# Altium schematic sheet Power.SchDoc
size A4
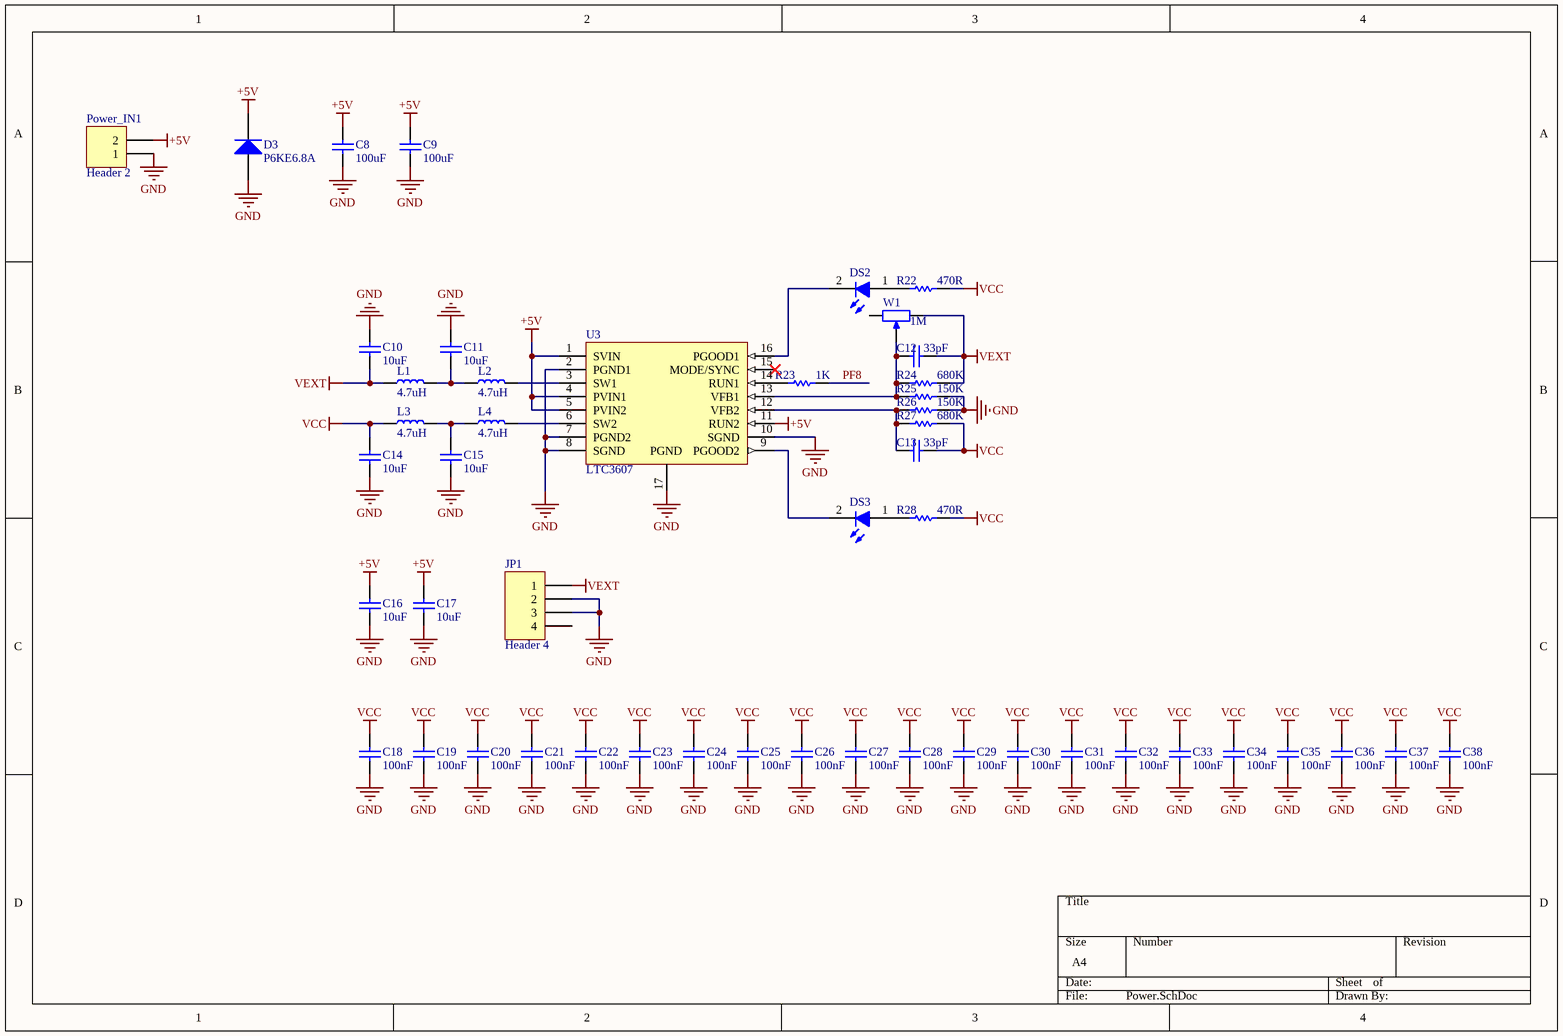
[diagram p0: Power.SchDoc]

## Parts
C8  100uF  [CAPC3225]
C9  100uF  [CAPC3225]
C10  10uF  [CAPC0805(2012)75_M]
C11  10uF  [CAPC0805(2012)75_M]
C12  33pF  [CAPC0603(1608)55_M]
C13  33pF  [CAPC0603(1608)55_M]
C14  10uF  [CAPC0805(2012)75_M]
C15  10uF  [CAPC0805(2012)75_M]
C16  10uF  [CAPC0805(2012)75_M]
C17  10uF  [CAPC0805(2012)75_M]
C18  100nF  [CAPC0603(1608)55_M]
C19  100nF  [CAPC0603(1608)55_M]
C20  100nF  [CAPC0603(1608)55_M]
C21  100nF  [CAPC0603(1608)55_M]
C22  100nF  [CAPC0603(1608)55_M]
C23  100nF  [CAPC0603(1608)55_M]
C24  100nF  [CAPC0603(1608)55_M]
C25  100nF  [CAPC0603(1608)55_M]
C26  100nF  [CAPC0603(1608)55_M]
C27  100nF  [CAPC0603(1608)55_M]
C28  100nF  [CAPC0603(1608)55_M]
C29  100nF  [CAPC0603(1608)55_M]
C30  100nF  [CAPC0603(1608)55_M]
C31  100nF  [CAPC0603(1608)55_M]
C32  100nF  [CAPC0603(1608)55_M]
C33  100nF  [CAPC0603(1608)55_M]
C34  100nF  [CAPC0603(1608)55_M]
C35  100nF  [CAPC0603(1608)55_M]
C36  100nF  [CAPC0603(1608)55_M]
C37  100nF  [CAPC0603(1608)55_M]
C38  100nF  [CAPC0603(1608)55_M]
D3  P6KE6.8A  [DO-214AC]
DS2  LED-BLUE  [0603LED_BLUE_V]  (value not drawn)
DS3  LED-BLUE  [0603LED_BLUE_V]  (value not drawn)
JP1  Header 4  [3.96-4-A]
L1  4.7uH  [CD32]
L2  4.7uH  [CD32]
L3  4.7uH  [CD32]
L4  4.7uH  [CD32]
Power_IN1  Header 2  [VH3.96-2-AW]
R22  470R  [RESC0603(1608)_M]
R23  1K  [RESC0603(1608)_M]
R24  680K  [RESC0603(1608)_M]
R25  150K  [RESC0603(1608)_M]
R26  150K  [RESC0603(1608)_M]
R27  680K  [RESC0603(1608)_M]
R28  470R  [RESC0603(1608)_M]
U3  LTC3607  [MSE16]
W1  1M  [VR5]

## Nets
+5V: C8.2 C9.2 C16.2 C17.2 D3.1(K) Power_IN1.2 U3.1(SVIN) U3.4(PVIN1) U3.5(PVIN2) U3.11(RUN2)
GND: C8.1 C9.1 C10.2 C11.2 C14.2 C15.2 C16.1 C17.1 C18.1 C19.1 C20.1 C21.1 C22.1 C23.1 C24.1 C25.1 C26.1 C27.1 C28.1 C29.1 C30.1 C31.1 C32.1 C33.1 C34.1 C35.1 C36.1 C37.1 C38.1 D3.2(A) JP1.2 JP1.3 Power_IN1.1 R25.1 R26.1 U3.2(PGND1) U3.7(PGND2) U3.8(SGND) U3.10(SGND) U3.17(PGND)
VCC: C13.2 C14.1 C18.2 C19.2 C20.2 C21.2 C22.2 C23.2 C24.2 C25.2 C26.2 C27.2 C28.2 C29.2 C30.2 C31.2 C32.2 C33.2 C34.2 C35.2 C36.2 C37.2 C38.2 L3.1 R22.1 R27.1 R28.1
VEXT: C10.1 C12.2 JP1.1 L1.1 R24.1 W1.3(BOT)
PF8: R23.1
NetC11_1: C11.1 L1.2 L2.1
NetC12_1: C12.1 R24.2 R25.2 U3.13(VFB1) W1.2(TAP)
NetC13_1: C13.1 R26.2 R27.2 U3.12(VFB2)
NetC15_1: C15.1 L3.2 L4.1
NetDS2_1: DS2.1(A) R22.2
NetDS2_2: DS2.2(K) U3.16(PGOOD1)
NetDS3_1: DS3.1(A) R28.2
NetDS3_2: DS3.2(K) U3.9(PGOOD2)
NetL2_2: L2.2 U3.3(SW1)
NetL4_2: L4.2 U3.6(SW2)
NetR23_2: R23.2 U3.14(RUN1)

Not connected (* = marked no-connect by the designer): JP1 4; U3 15(MODE/SYNC)*; W1 1(TOP)

## Library data of the parts
C8-C38 = CAP
D3 = Diode: pin to pad: 1>2 2>1
JP1 = Header 4: Header, 4-Pin; Manufacturer: Generic Components; Class: Connector
L1-L4 = Inductor
Power_IN1 = Header 2: Header, 2-Pin; LatestRevisionDate: 17-Jul-2002; LatestRevisionNote: Re-released for DXP Platform.; Publisher: Altium Limited
R22-R28 = RES
W1 = RPot2: Potentiometer; Manufacturer: Generic Components; Class: Passive; Set Position: 0.5; Value: 1K; Published: 08/06/2000; Publisher: Altium Hobart Technology Centre; SubClass: Potentiometer